# EAGLE design servo_board_old (EAGLE 5.06)
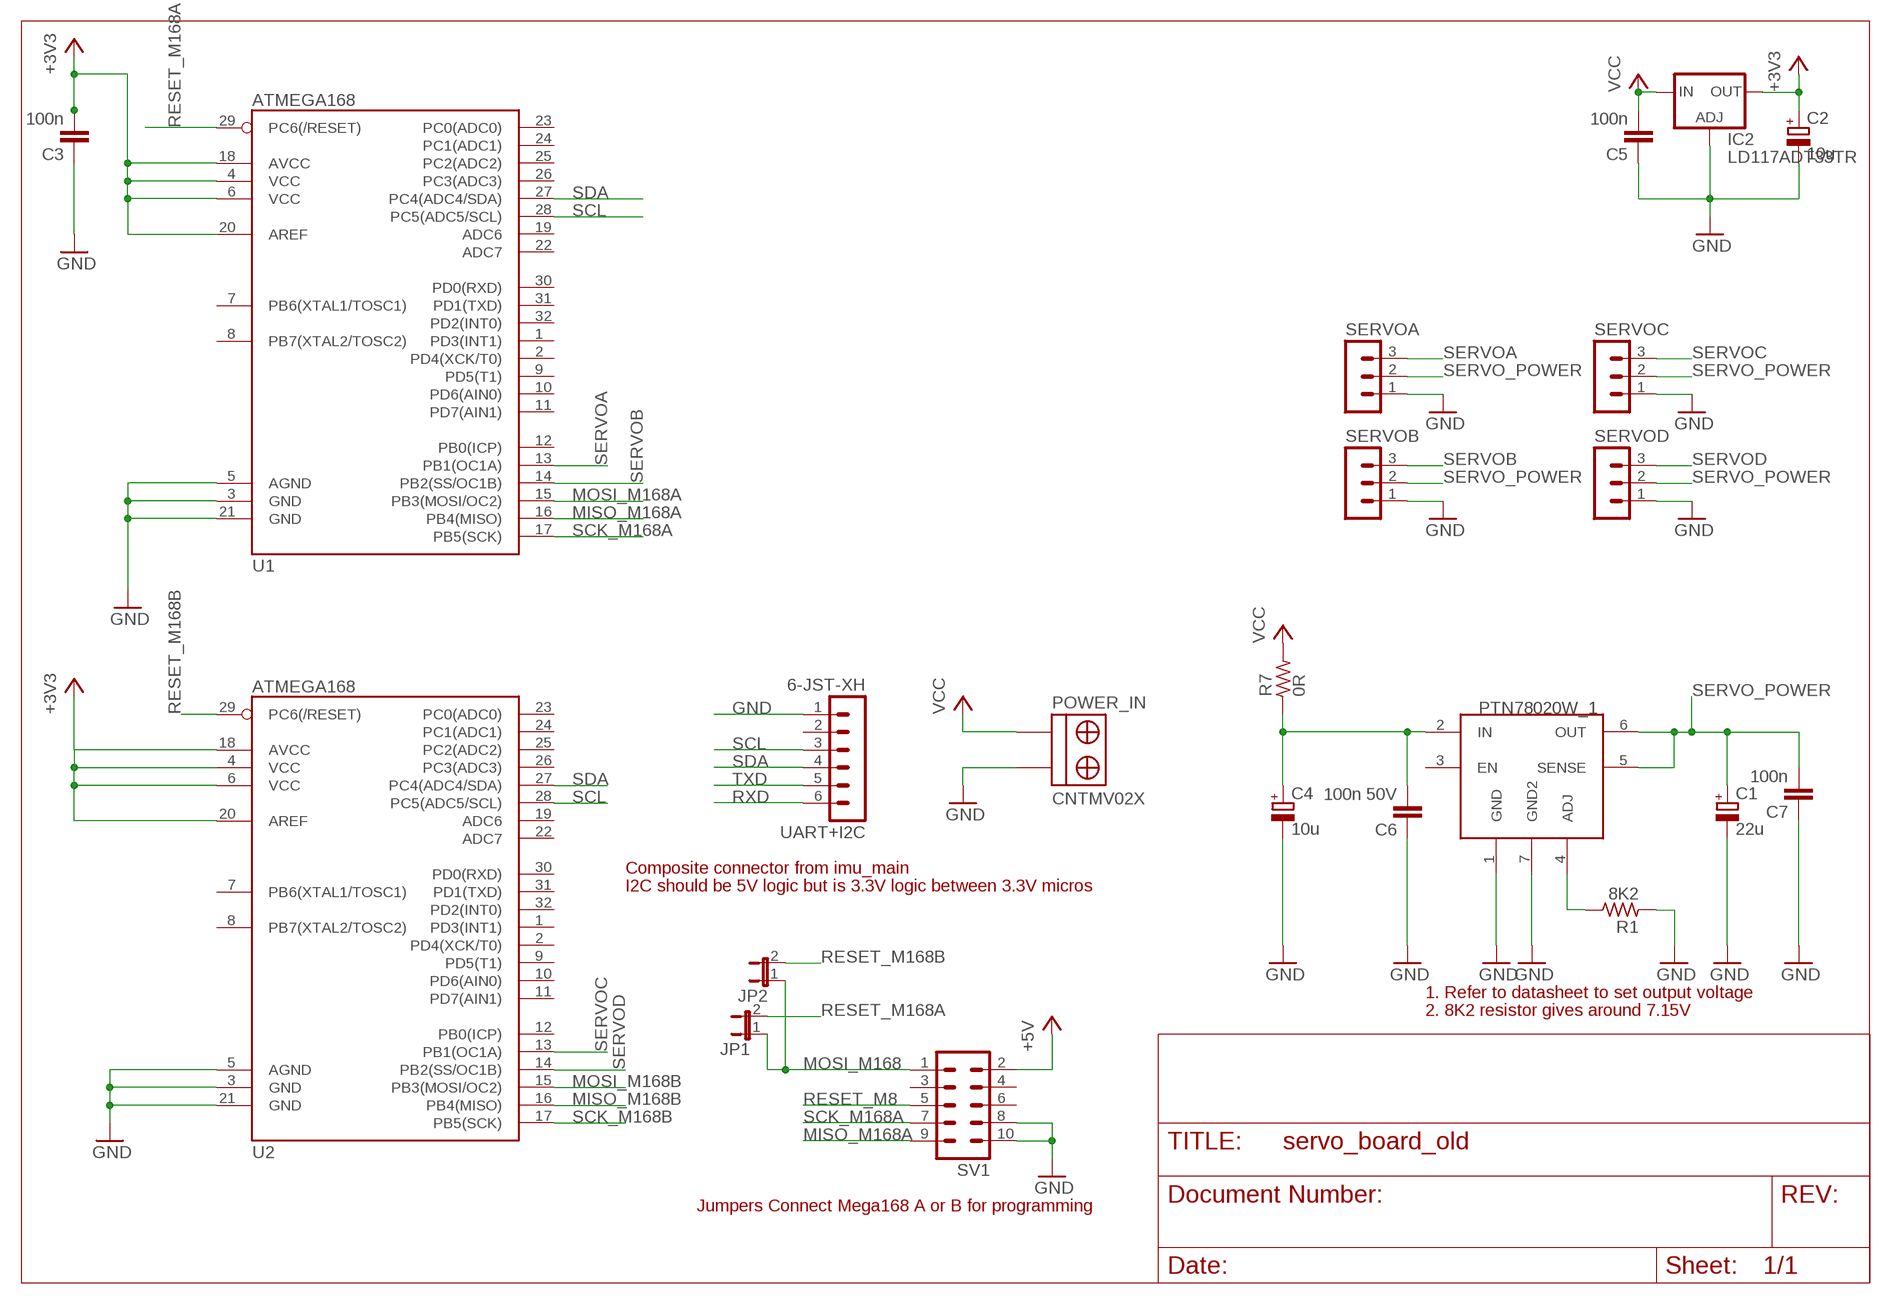
[diagram p0: schematic, sheet 1]

## Parts
C1  22u  CPOL-EUC/6032-28R  [C/6032-28R]
C2  10u  CPOL-EUC/6032-28R  [C/6032-28R]
C3  100n  C-EUC0805  [C0805]
C4  10u  CPOL-EUC/6032-28R  [C/6032-28R]
C5  100n  C-EUC0805  [C0805]
C6  100n 50V  C-EUC3216  [C3216]
C7  100n  C-EUC3216  [C3216]
IC2  LD117ADT33TR  [DPACK]
JP1  JP1E  [JP1]
JP2  JP1E  [JP1]
POWER_IN  CNTMV02X  [CNTMV02X]
PTN78020W_1  PTN78020  [PTN78020]
R1  8K2  R_2012  [R2012]
R7  0R  R_2512  [R2512]
SERVOA  MA03-1  [MA03-1]
SERVOB  MA03-1  [MA03-1]
SERVOC  MA03-1  [MA03-1]
SERVOD  MA03-1  [MA03-1]
SV1  MA05-2  [MA05-2]
U1  ATMEGA168  [TQFP32-08]
U2  ATMEGA168  [TQFP32-08]
UART+I2C  6-JST-XH  [6]

## Nets
+3V3: C2.+ C3.2 IC2.4(OUT) U1.4(VCC) U1.6(VCC) U1.18(AVCC) U1.20(AREF) U2.4(VCC) U2.6(VCC) U2.18(AVCC) U2.20(AREF)
+5V: SV1.2
GND: C1.- C2.- C3.1 C4.- C5.1 C6.1 C7.1 IC2.1(ADJ) POWER_IN.1(+) PTN78020W_1.1(GND) PTN78020W_1.7(GND2) R1.1 SERVOA.1 SERVOB.1 SERVOC.1 SERVOD.1 SV1.8 SV1.10 U1.3(GND) U1.5(AGND) U1.21(GND) U2.3(GND) U2.5(AGND) U2.21(GND) UART+I2C.1
MISO_M168A: SV1.9 U1.16(PB4(MISO))
MISO_M168B: U2.16(PB4(MISO))
MOSI_M168: JP1.1 JP2.1 SV1.1
MOSI_M168A: U1.15(PB3(MOSI/OC2))
MOSI_M168B: U2.15(PB3(MOSI/OC2))
N$10: PTN78020W_1.4(ADJ) R1.2
N$11: C4.+ C6.2 PTN78020W_1.2(IN) R7.1
RESET_M8: SV1.5
RESET_M168A: JP1.2 U1.29(PC6(/RESET))
RESET_M168B: JP2.2 U2.29(PC6(/RESET))
RXD: UART+I2C.6
SCK_M168A: SV1.7 U1.17(PB5(SCK))
SCK_M168B: U2.17(PB5(SCK))
SCL: U1.28(PC5(ADC5/SCL)) U2.28(PC5(ADC5/SCL)) UART+I2C.3
SDA: U1.27(PC4(ADC4/SDA)) U2.27(PC4(ADC4/SDA)) UART+I2C.4
SERVO_POWER: C1.+ C7.2 PTN78020W_1.5(SENSE) PTN78020W_1.6(OUT) SERVOA.2 SERVOB.2 SERVOC.2 SERVOD.2
SERVOA: SERVOA.3 U1.13(PB1(OC1A))
SERVOB: SERVOB.3 U1.14(PB2(SS/OC1B))
SERVOC: SERVOC.3 U2.13(PB1(OC1A))
SERVOD: SERVOD.3 U2.14(PB2(SS/OC1B))
TXD: UART+I2C.5
VCC: C5.2 IC2.3(IN) POWER_IN.2(-) R7.2
Unconnected: PTN78020W_1.3(EN) SV1.3 SV1.4 SV1.6 U1.1(PD3(INT1)) U1.2(PD4(XCK/T0)) U1.7(PB6(XTAL1/TOSC1)) U1.8(PB7(XTAL2/TOSC2)) U1.9(PD5(T1)) U1.10(PD6(AIN0)) U1.11(PD7(AIN1)) U1.12(PB0(ICP)) U1.19(ADC6) U1.22(ADC7) U1.23(PC0(ADC0)) U1.24(PC1(ADC1)) U1.25(PC2(ADC2)) U1.26(PC3(ADC3)) U1.30(PD0(RXD)) U1.31(PD1(TXD)) U1.32(PD2(INT0)) U2.1(PD3(INT1)) U2.2(PD4(XCK/T0)) U2.7(PB6(XTAL1/TOSC1)) U2.8(PB7(XTAL2/TOSC2)) U2.9(PD5(T1)) U2.10(PD6(AIN0)) U2.11(PD7(AIN1)) U2.12(PB0(ICP)) U2.19(ADC6) U2.22(ADC7) U2.23(PC0(ADC0)) U2.24(PC1(ADC1)) U2.25(PC2(ADC2)) U2.26(PC3(ADC3)) U2.30(PD0(RXD)) U2.31(PD1(TXD)) U2.32(PD2(INT0)) UART+I2C.2

## Notes on the sheet
- Composite connector from imu_main
- I2C should be 5V logic but is 3.3V logic between 3.3V micros
- 1. Refer to datasheet to set output voltage
- 2. 8K2 resistor gives around 7.15V
- Jumpers Connect Mega168 A or B for programming

## Library data of the parts
C1 C2 C4 = rcl:CPOL-EU: POLARIZED CAPACITOR, European symbol
C3 C5-C7 = rcl:C-EU: CAPACITOR, European symbol
IC2 = v-reg:LD117A?*: Low drop fixed and adjustable positive voltage regulators 1 A Source: http://www.st.com/stonline/products/literature/ds/7194/ld1117axx.pdf
JP1 JP2 = jumper:JP1E: JUMPER
POWER_IN = robert-custom:CNTMV02X
PTN78020W_1 = robert-custom:PTN78020
R1 R7 = rc-master-smd:R_: RESISTOR
SERVOA SERVOB SERVOC SERVOD = con-lstb:MA03-1: PIN HEADER
SV1 = con-lstb:MA05-2: PIN HEADER
U1 U2 = SparkFun:ATMEGA168
UART+I2C = con-jst-xh:6-JST-XH

## Board
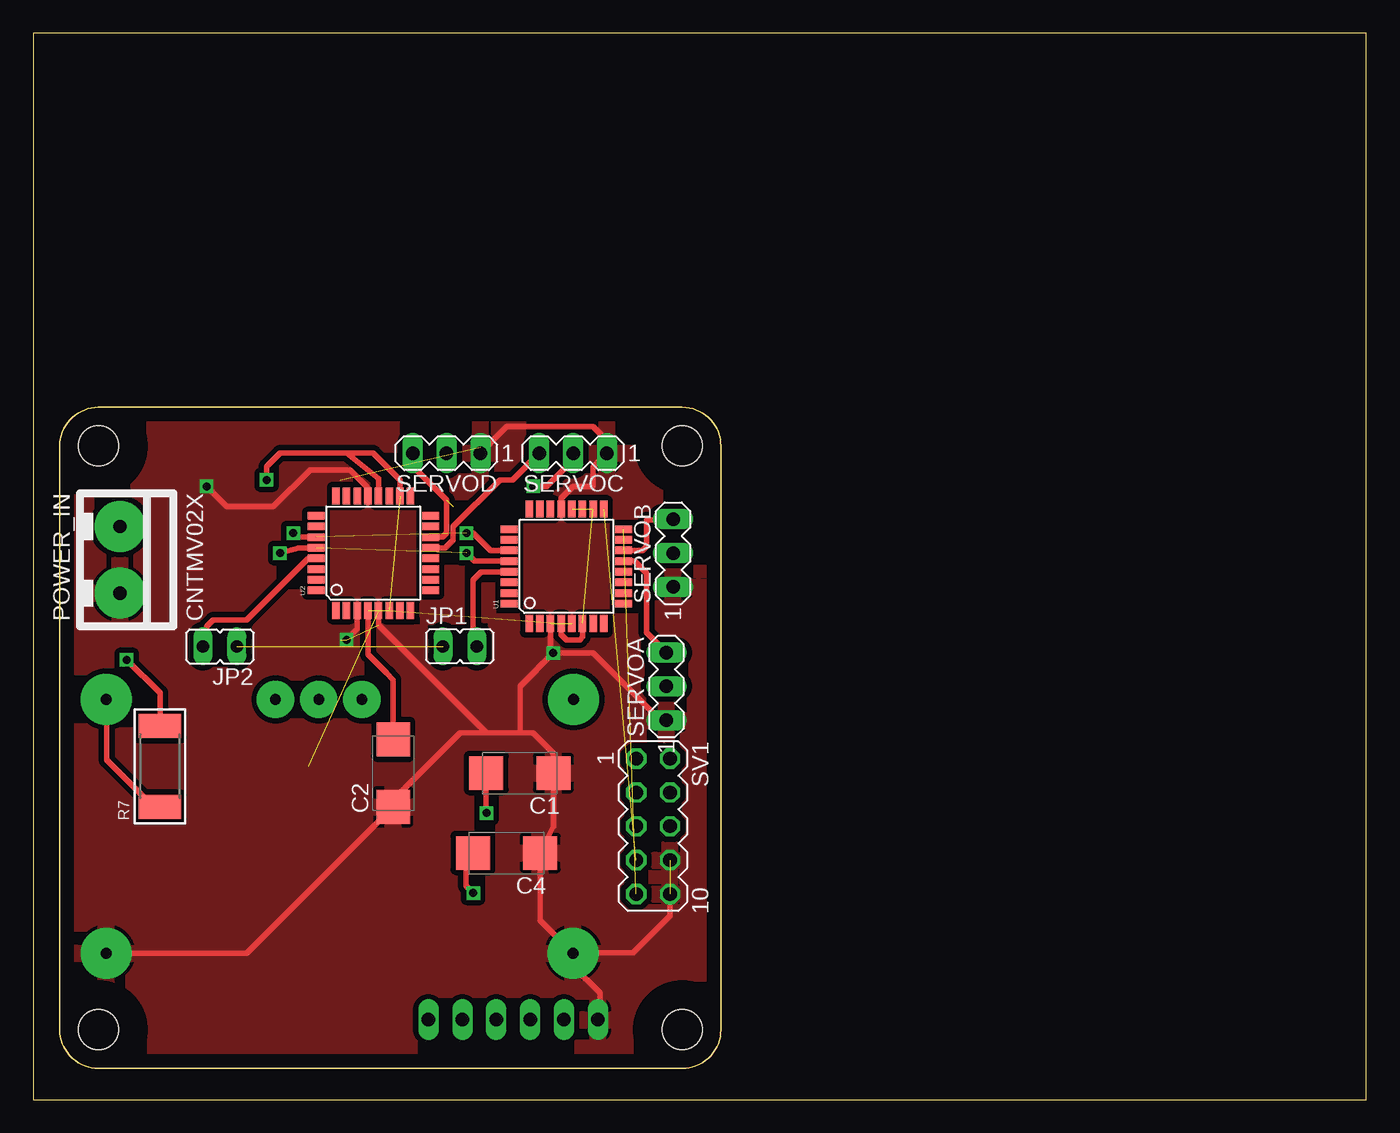
[diagram p1: board, top side]
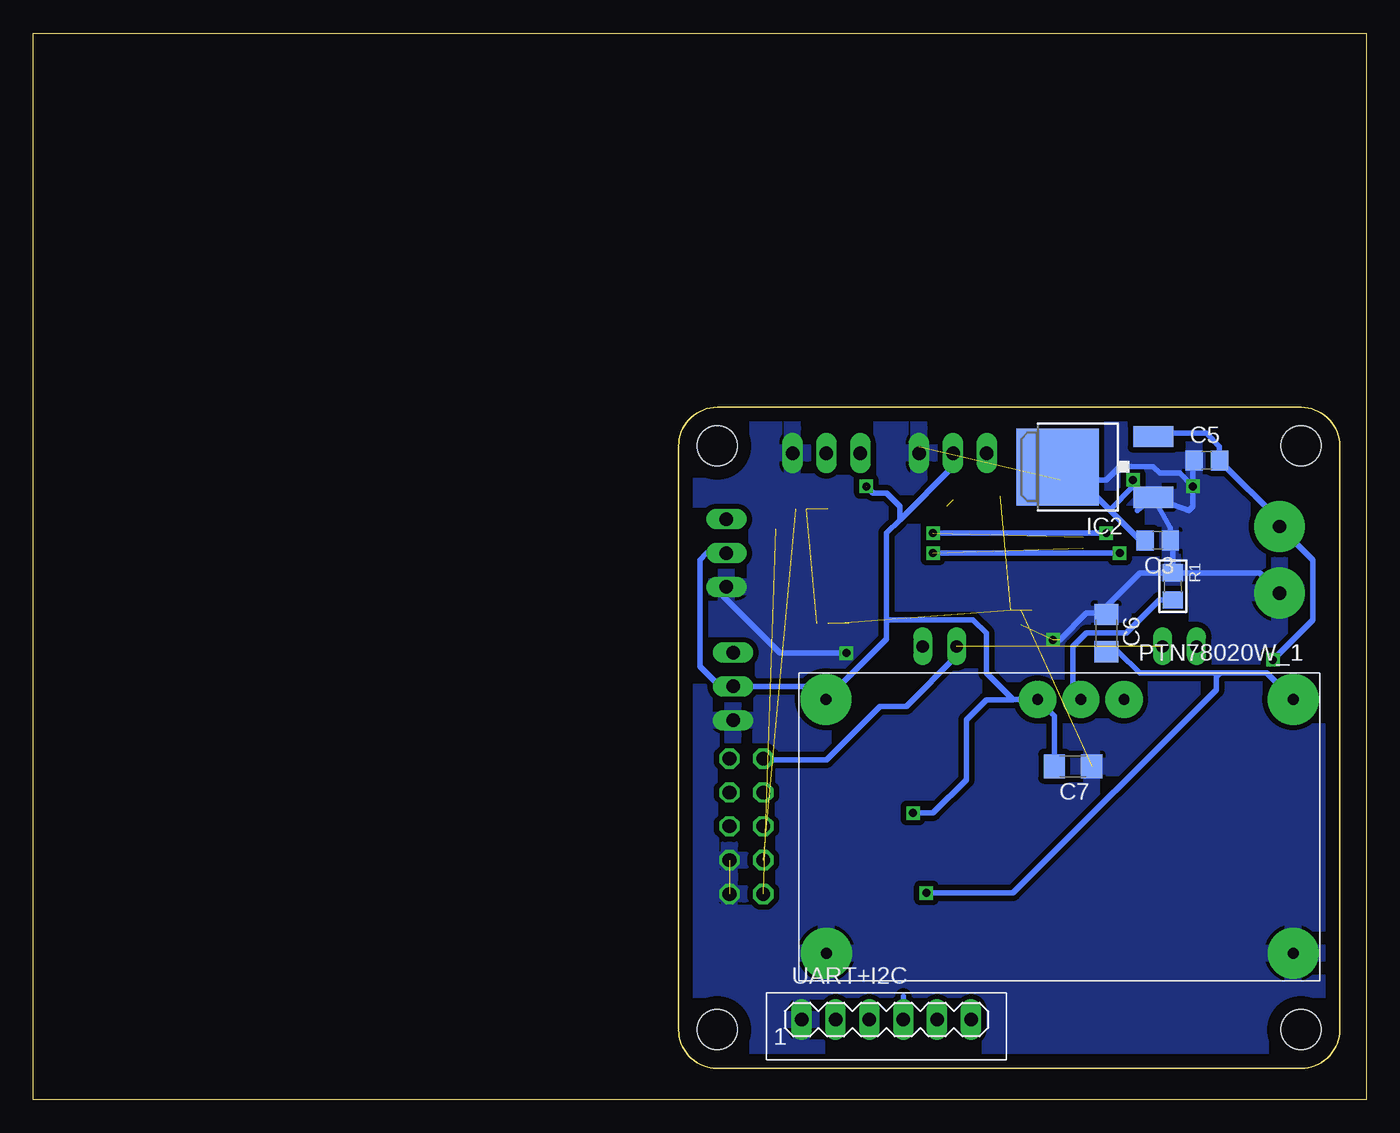
[diagram p2: board, bottom side, seen from below]

Size 100 x 80 mm. Coordinates in mm from the lower left corner, seen from the top.
Outline: 0,0 100,0 100,80 0,80 0,0
Outline: 1.99,5.24 1.99,49.04 arc-90 4.89,51.94 48.69,51.94 arc-90 51.59,49.04 51.59,5.24 arc-90 48.69,2.34 4.89,2.34 arc-90 1.99,5.24
Copper layers (1*16): Top 0.035mm / dielectric 1.5mm / Bottom 0.035mm
Design rules "default": minimum track width 10mil, minimum drill 24mil, track to track 8mil, track to pad 8mil, pad to pad 8mil, via to via 8mil, smd to smd 8mil, copper to edge 40mil, drill to drill 8mil, minimum pad ring 10mil, minimum via ring 8mil, stop-mask expansion 4mil, vias tented up to drill 0mil, thermal gap 10mil
Holes 3 mm at 4.89,49.04 48.69,49.04 4.89,5.24 48.69,5.24
tRestrict: area 1.8,45.9 to 8,52.1; area 45.7,46 to 51.9,52.2; area 45.6,2.1 to 51.8,8.3; area 1.8,2.1 to 8,8.3

### Footprints (pad centres in the part's own frame; a part is rotated, then mirrored left to right if it is on the bottom)
C/6032-28R = smd 2.55 x 2.5: + 2.525,0; - -2.525,0
C0805 = smd 1.3 x 1.5: 1 -0.95,0; 2 0.95,0
C3216 = smd 1.6 x 1.8: 1 -1.4,0; 2 1.4,0
DPACK = smd 1.6 x 3: 1 -2.28,-4.8; 3 2.28,-4.8 | smd 5.8 x 6.2: 4 0,2.38
JP1 = drill 0.914 long: 1 0,-1.27; 2 0,1.27
CNTMV02X = drill 1 pad 3.81 round: 1 2.5,0; 2 -2.5,0
PTN78020 = drill 0.8 pad 3.81 round: 1 -17.526,9.525; 2 -17.526,-9.525; 6 17.531,-9.525; 7 17.499,9.525 | drill 0.8 pad 2.794 round: 3 -4.831,-9.525; 4 -1.587,-9.525; 5 1.656,-9.525
R2012 = smd 1.3 x 1.5: 1 -1.016,0; 2 1.016,0
R2512 = smd 1.8 x 3.2: 1 -3.048,0; 2 3.048,0
MA03-1 = drill 1.016 long: 1 -2.54,0; 2 0,0; 3 2.54,0
MA05-2 = drill 1.016 octagon: 1 -5.08,-1.27; 2 -5.08,1.27; 3 -2.54,-1.27; 4 -2.54,1.27; 5 0,-1.27; 6 0,1.27; 7 2.54,-1.27; 8 2.54,1.27; 9 5.08,-1.27; 10 5.08,1.27
TQFP32-08 = smd 1.27 x 0.559: 1 -4.293,2.8; 2 -4.293,2; 3 -4.293,1.2; 4 -4.293,0.4; 5 -4.293,-0.4; 6 -4.293,-1.2; 7 -4.293,-2; 8 -4.293,-2.8; 17 4.293,-2.8; 18 4.293,-2; 19 4.293,-1.2; 20 4.293,-0.4; 21 4.293,0.4; 22 4.293,1.2; 23 4.293,2; 24 4.293,2.8 | smd 0.559 x 1.27: 9 -2.8,-4.293; 10 -2,-4.293; 11 -1.2,-4.293; 12 -0.4,-4.293; 13 0.4,-4.293; 14 1.2,-4.293; 15 2,-4.293; 16 2.8,-4.293; 25 2.8,4.293; 26 2,4.293; 27 1.2,4.293; 28 0.4,4.293; 29 -0.4,4.293; 30 -1.2,4.293; 31 -2,4.293; 32 -2.8,4.293
6 = drill 1.016 long: 1 -6.35,0; 2 -3.81,0; 3 -1.27,0; 4 1.27,0; 5 3.81,0; 6 6.35,0

### Placement (x,y rotation side)
C1  36.5,24.5 180 top
C2  27,24.5 90 top
C3  15.64,41.96 180 bottom
C4  35.5,18.5 180 top
C5  11.96,47.95 0 bottom
C6  19.5,35 270 bottom
C7  22,25 180 bottom
IC2  20.78,47.46 90 bottom
JP1  32,34 270 top
JP2  14,34 90 top
POWER_IN  6.5,40.5 270 top
PTN78020W_1  23,20.5 180 bottom
R1  14.5,38.5 270 bottom
R7  9.5,25 90 top
SERVOA  47.5,31 90 top
SERVOB  48,41 90 top
SERVOC  40.5,48.5 180 top
SERVOD  31,48.5 180 top
SV1  46.5,20.5 270 top
U1  40,40 90 top
U2  25.5,41 90 top
UART+I2C  36,6 0 bottom

### Tracks (layer width: path | path; a pad name or v marks a point on that pad's centre or on a via)
+3V3  (via drill 0.6)  (5 unrouted)
  Top 0.406: U2.20 25.9,46.6 23.5,48.5 | v17.5,46.5 17.5,47.5 18.5,48.5 23.5,48.5 | U1.4 39.6,34.9 40,34.5 41,34.5 41.2,34.7 U1.6 | U2.4 25.1,33.4 26.5,32 27,31.5 C2.+ | U2.18 27.5,46.5 25.5,48.5 23.5,48.5
  Bottom 0.406: C3.2 16.96,41.96 19.25,44.25 | 21.5,46.5 23.12,46.5 IC2.4 21.46,46.46 19.25,44.25 | v17.5,46.5 17.5,46 19.25,44.25
GND  (via drill 0.6)  (6 unrouted)
  Top 0.406: U1.21 39.6,45.1 40.5,46 42,46 42,47.46 SERVOC.1 43,49.5 42,50.5 35.5,50.5 SERVOD.1 | U2.21 25.1,45.9 23.75,47.25 20.75,47.25 18,44.5 14.5,44.5 v13,46 | U1.3 38.8,33.7 v39,33.5 | U2.5 25.9,35.6 34,27.5 | 34,27.5 36.5,27.5 | 36.5,27.5 37.5,27.5 39,26 39,24.52 C1.- 39.02,20.5 C4.- 38.02,13.45 PTN78020W_1.7 | v39,33.5 36.5,31 36.5,27.5 | SV1.10 47.77,13.77 45,11 40.52,11 PTN78020W_1.7 | PTN78020W_1.7 40.5,10 42.5,8 42.5,6.15 UART+I2C.1 | PTN78020W_1.1 16,10.97 C2.- 27,22.5 32,27.5 34,27.5 | SERVOA.1 47.04,28.46 42,33.5 v39,33.5 | U2.3 24.3,35.3 v23.5,34.5
  Bottom 0.406: 33.54,48.96 SERVOD.1 | R1.1 14.52,39.5 17,39.5 20,36.5 C6.1 20.1,36.5 21,36.5 23,34.5 | R1.1 14.5,41.77 C3.1 14.69,42.89 IC2.1 | R1.1 14.5,39.5 8,39.5 POWER_IN.1 | IC2.1 17.18,44.18 | 23,46.5 19.5,46.5 18.5,47.5 16,47.5 15.5,47 14,47 v13,46 | IC2.1 13.32,44.18 13,44.5 v13,46 | v13,46 13,47.86 C5.1 | SERVOB.1 48.5,38 44,33.5 v39,33.5
  pour Top (isolate 0.406): 2.5,3 51,3 51,51.5 2.5,51.5
  pour Bottom (isolate 0.406): 3,3 51,3 51,51.5 2.5,51.5 2.5,3
MISO_M168A  (1 unrouted)
MOSI_M168  (1 unrouted)
  Bottom 0.406: JP1.1 30.73,33.27 34.5,29.5 36.5,29.5 40.5,25.5 45.15,25.5 SV1.1
N$8  (via drill 0.6)
  other vias: 37.5,46
N$10
  Bottom 0.406: R1.2 15.52,37.48 18,35 21,35 22,34 22,30.61 PTN78020W_1.4
N$11  (via drill 0.6)
  Top 0.406: C4.+ 32.48,19 32.48,16.02 v33,15.5 | R7.1 9.05,21.95 5.5,25.5 5.5,30 PTN78020W_1.2
  Bottom 0.406: C6.2 18.6,33.6 17,32 11,32 | v33,15.5 26.5,15.5 11.25,30.75 11.25,31.75 11,32 | 11,32 7.45,32 PTN78020W_1.2
N$25  (via drill 0.6)
  other vias: 33,15.5
N$26  (via drill 0.6)
  other vias: 34,21.5
RESET_M168A
  Top 0.406: U1.29 33.6,39.6 33,39 33,34.27 JP1.2
RESET_M168B
  Top 0.406: U2.29 20.6,40.6 16,36 13.5,36 13,35.5 13,34.27 JP2.2
SCK_M168A  (1 unrouted)
SCL  (via drill 0.6)  (1 unrouted)
  Top 0.406: U2.28 19.9,41.4 v18.5,41 | U1.28 33.1,40.4 v32.5,41
  Bottom 0.406: v18.5,41 v32.5,41
SDA  (via drill 0.6)  (1 unrouted)
  Top 0.406: U2.27 19.8,42.2 v19.5,42.5 | U1.27 34.3,41.2 33,42.5 v32.5,42.5
  Bottom 0.406: UART+I2C.4 34.73,7.73 | v19.5,42.5 v32.5,42.5
SERVO_POWER  (via drill 0.6)  (1 unrouted)
  Top 0.406: SERVOC.2 40.5,48 38.5,46 37.5,46 | C1.+ 33.98,21.52 v34,21.5
  Bottom 0.406: SERVOD.2 31,47.5 35,43.5 | 35,43.5 36,42.5 36,36 | 35,43.5 35,44.5 36,45.5 37,45.5 37.5,46 | 36,36 36,34.56 PTN78020W_1.6 41.51,31 SERVOA.2 48.5,31 50,32.5 50,40.5 49.5,41 SERVOB.2 | 26.52,30.02 28.5,32 28.5,35 29.5,36 36,36 | v34,21.5 32.5,21.5 30,24 30,28.5 28.5,30 26.55,30 26.52,30.02 | C7.2 23.4,28.77 PTN78020W_1.5 26.52,30.02
SERVOA
  Top 0.406: U1.13 45.1,40.4 46,39.5 46,35.04 SERVOA.3
SERVOB
  Top 0.406: U1.14 45.7,41.2 46,41.5 46,43.5 48.46,43.5 SERVOB.3
SERVOC
  Top 0.406: U2.13 30.9,41.4 31.5,42 31.5,43 35,46.5 35.96,46.5 SERVOC.3
SERVOD  (1 unrouted)
  Top 0.406: SERVOD.3 28.46,47.54 31,45 31,42.5 30.7,42.2 U2.14
VCC  (via drill 0.6)
  Top 0.406: R7.2 9.5,30.5 v7,33
  Bottom 0.406: IC2.3 14.72,50 12,50 11.01,49.01 C5.2 6.5,43.44 POWER_IN.2 4,40.5 4,36 v7,33